# Altium schematic sheet Gandhvedh.U.K.SchDoc
size D
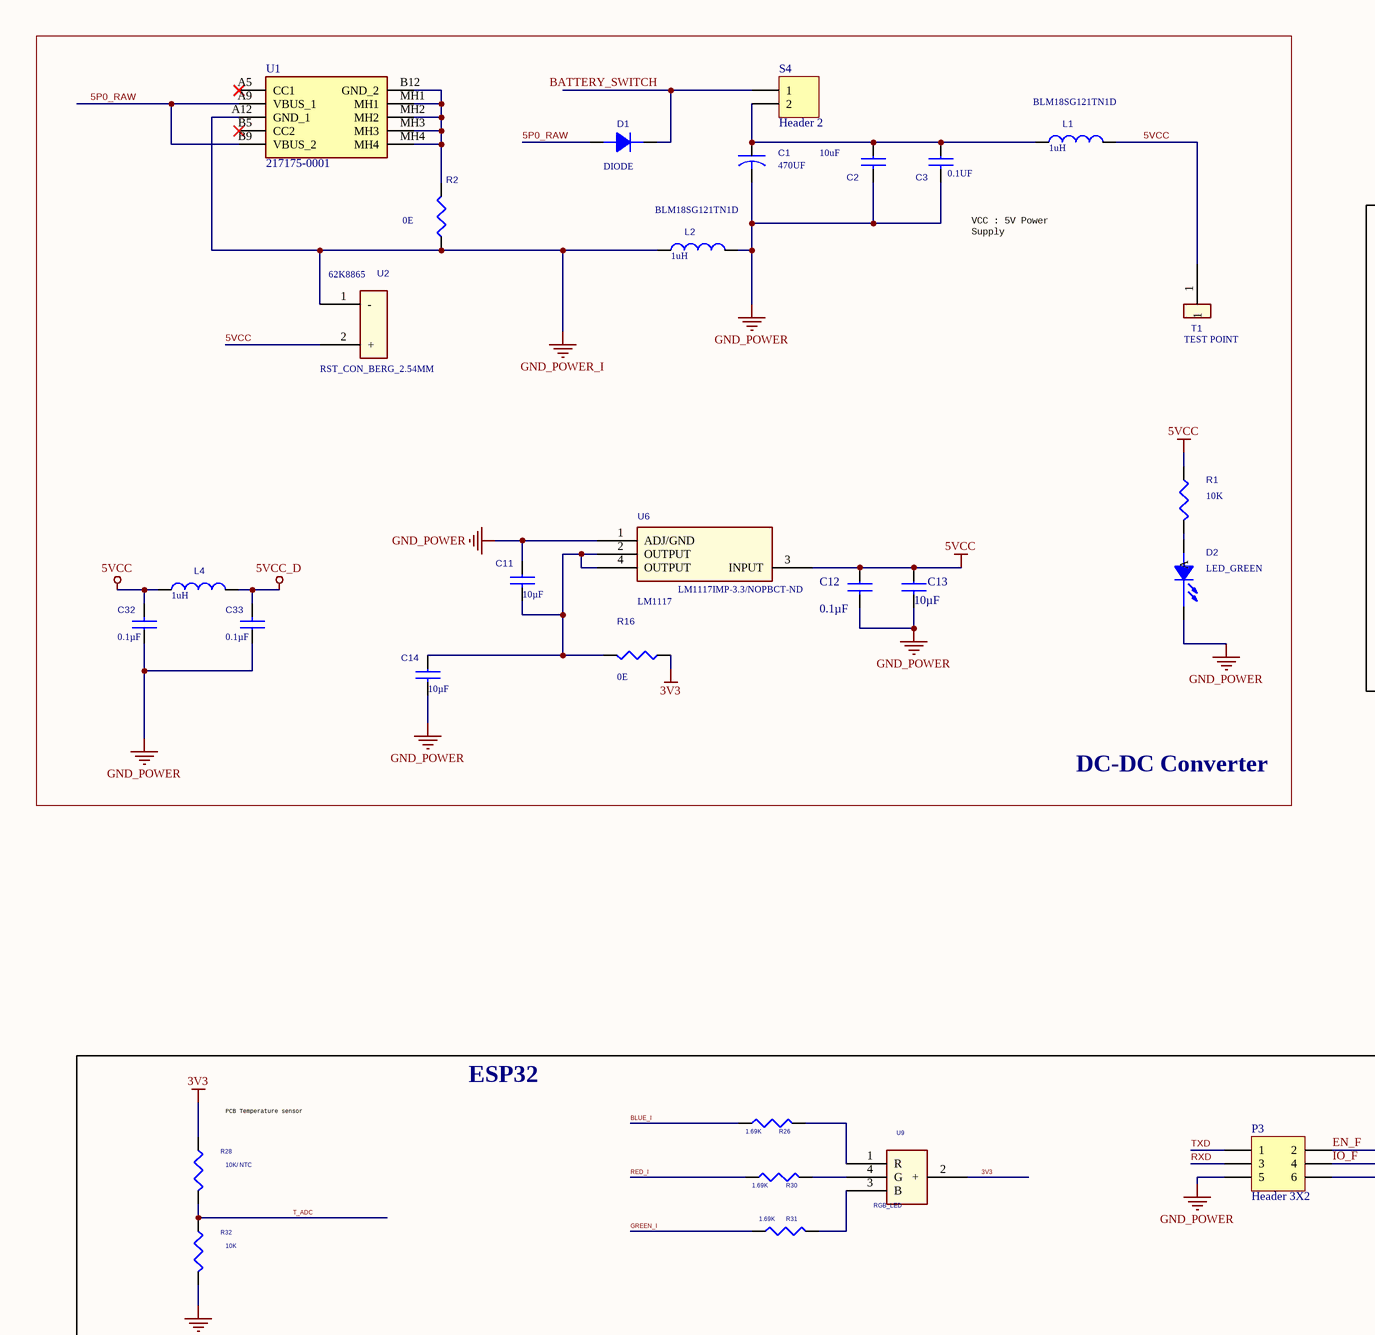
[diagram p0: Gandhvedh.U.K.SchDoc, top left]
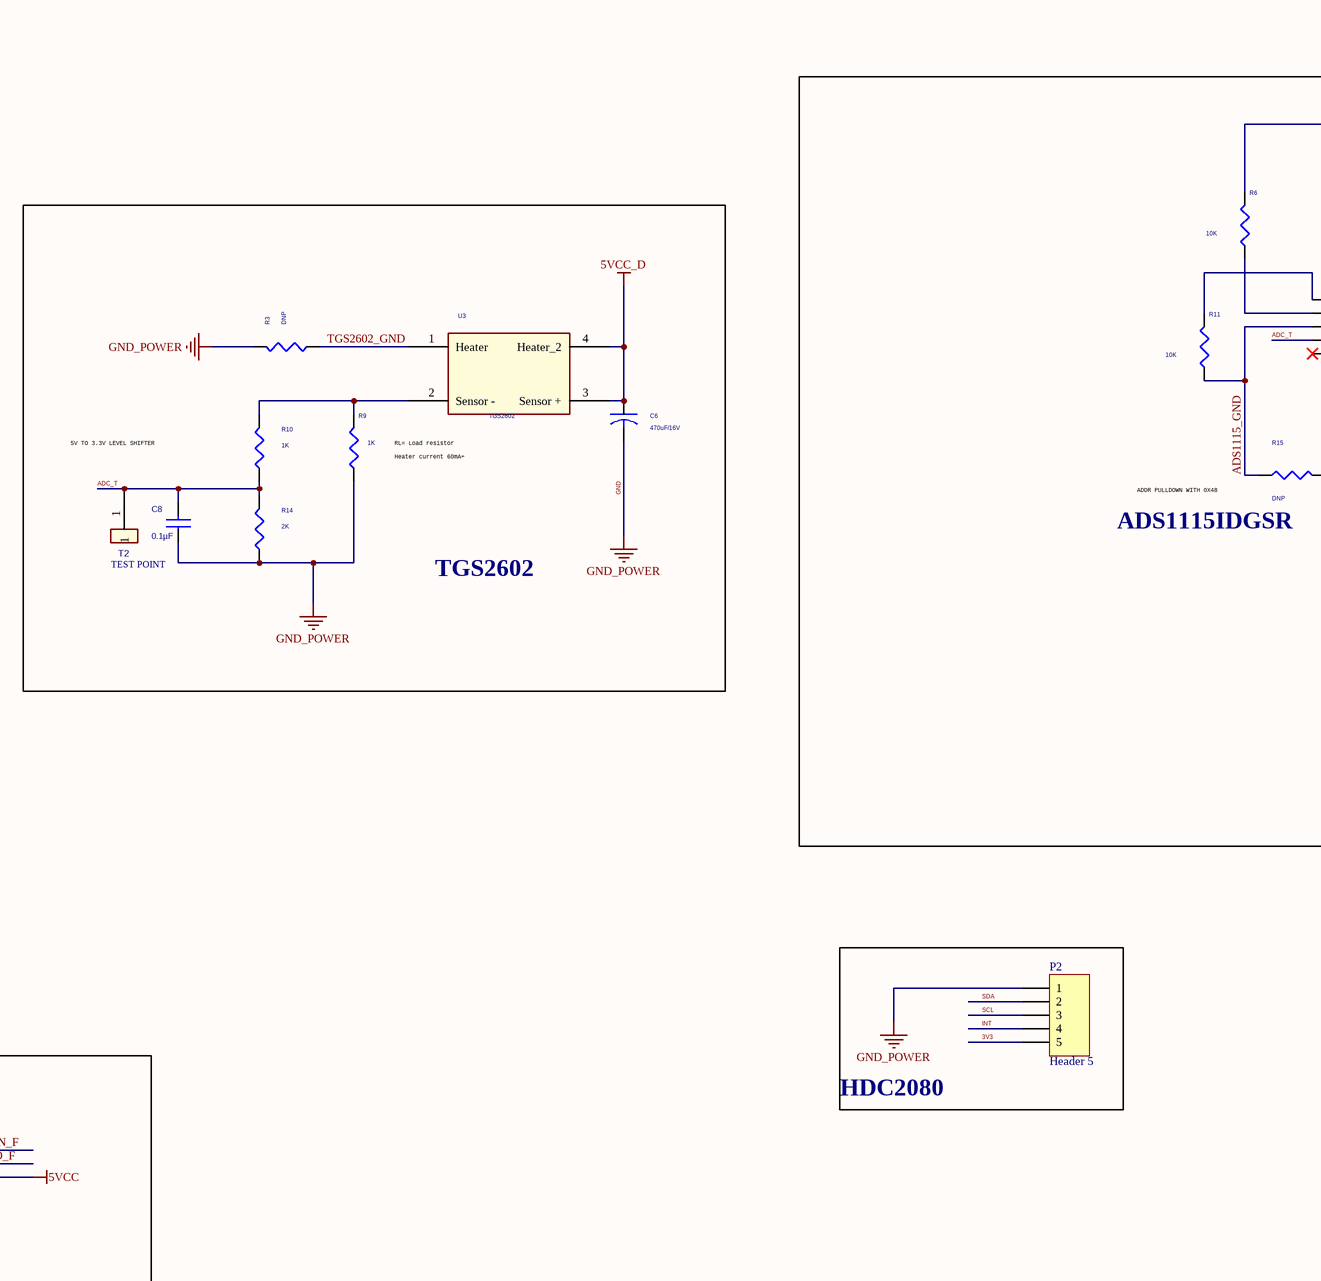
[diagram p1: Gandhvedh.U.K.SchDoc, top middle]
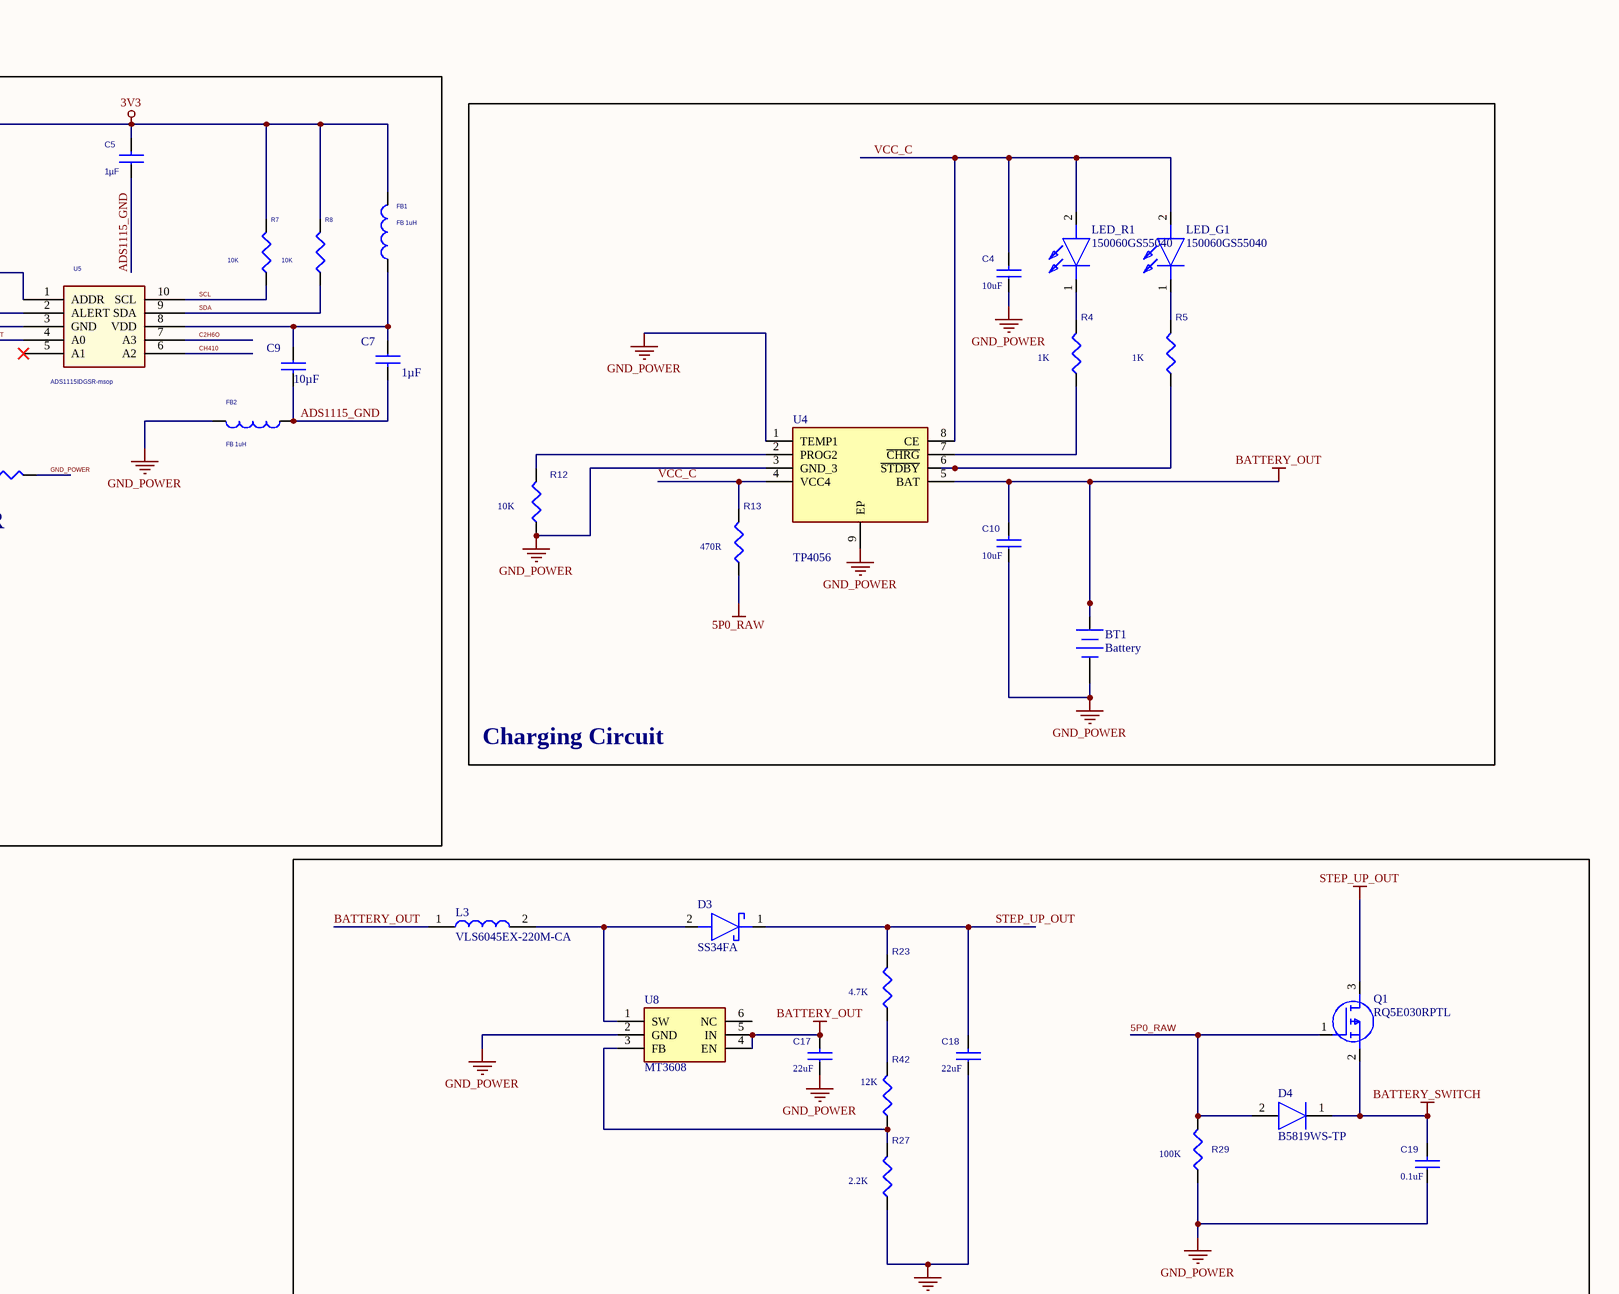
[diagram p2: Gandhvedh.U.K.SchDoc, top right]
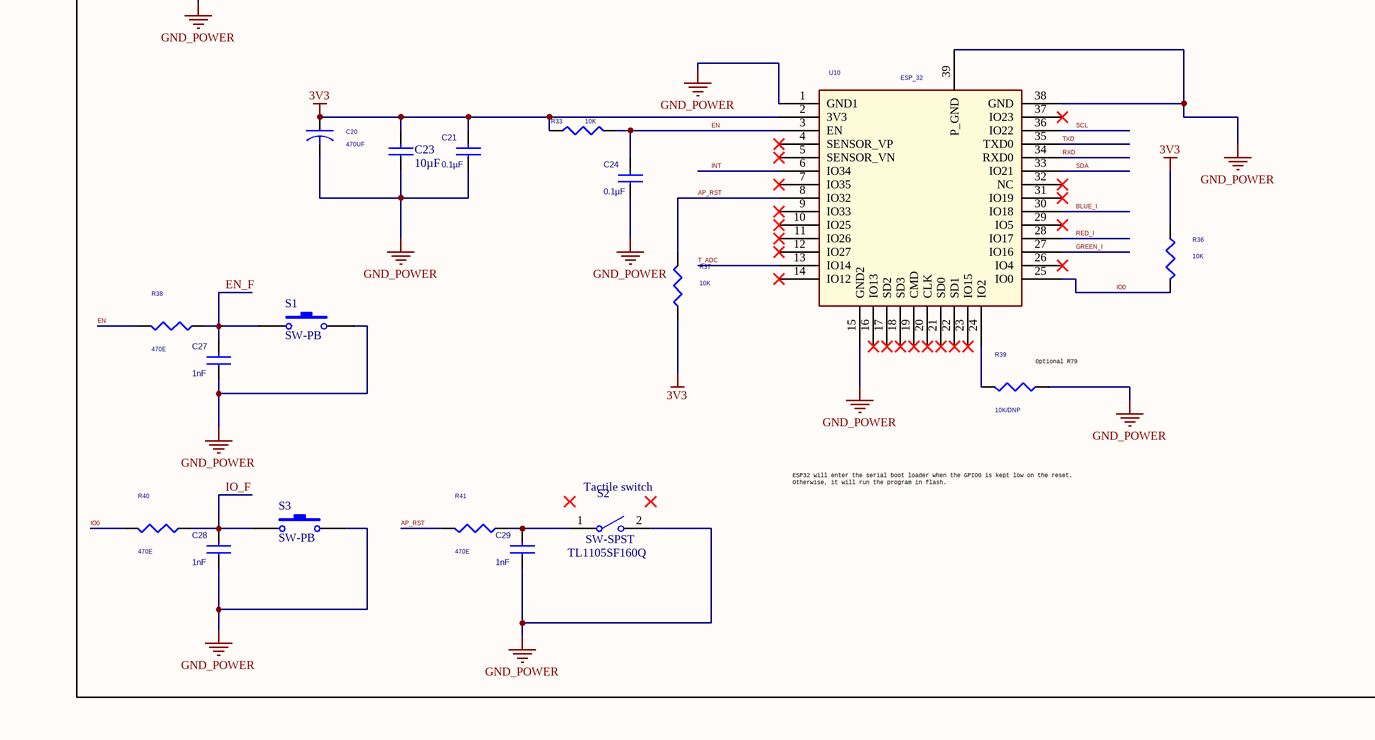
[diagram p3: Gandhvedh.U.K.SchDoc, bottom left]
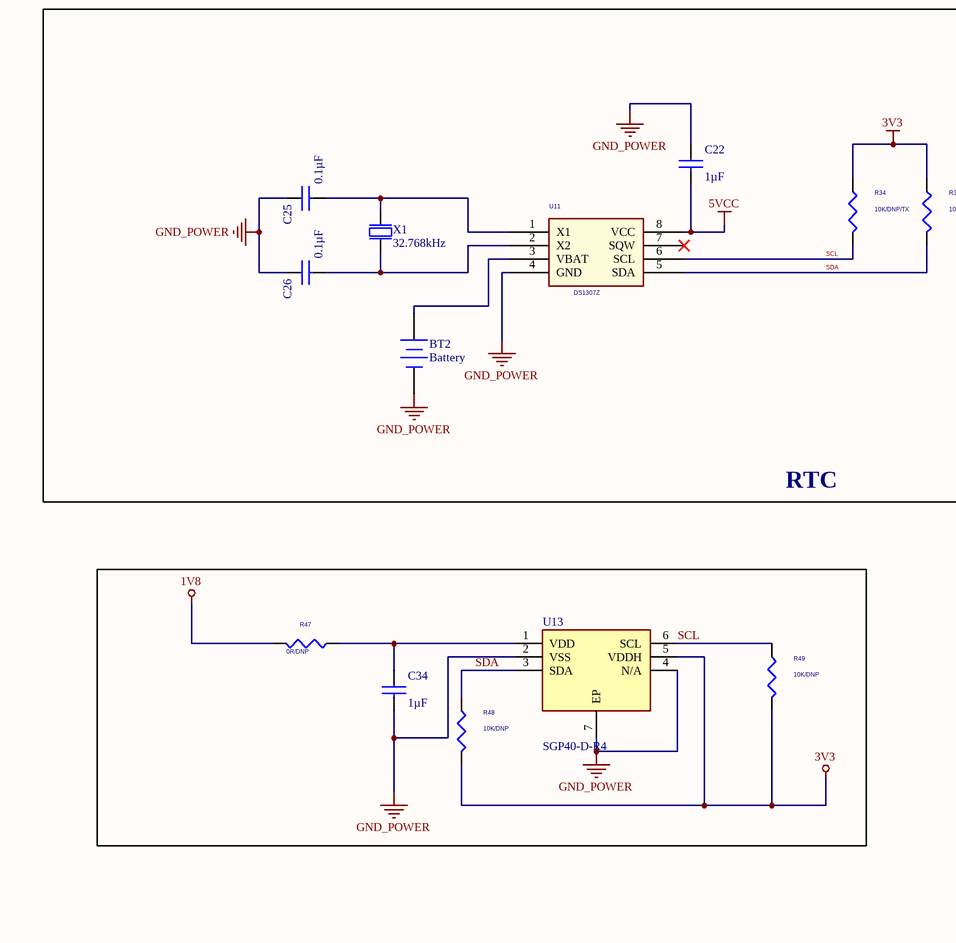
[diagram p4: Gandhvedh.U.K.SchDoc, bottom middle]
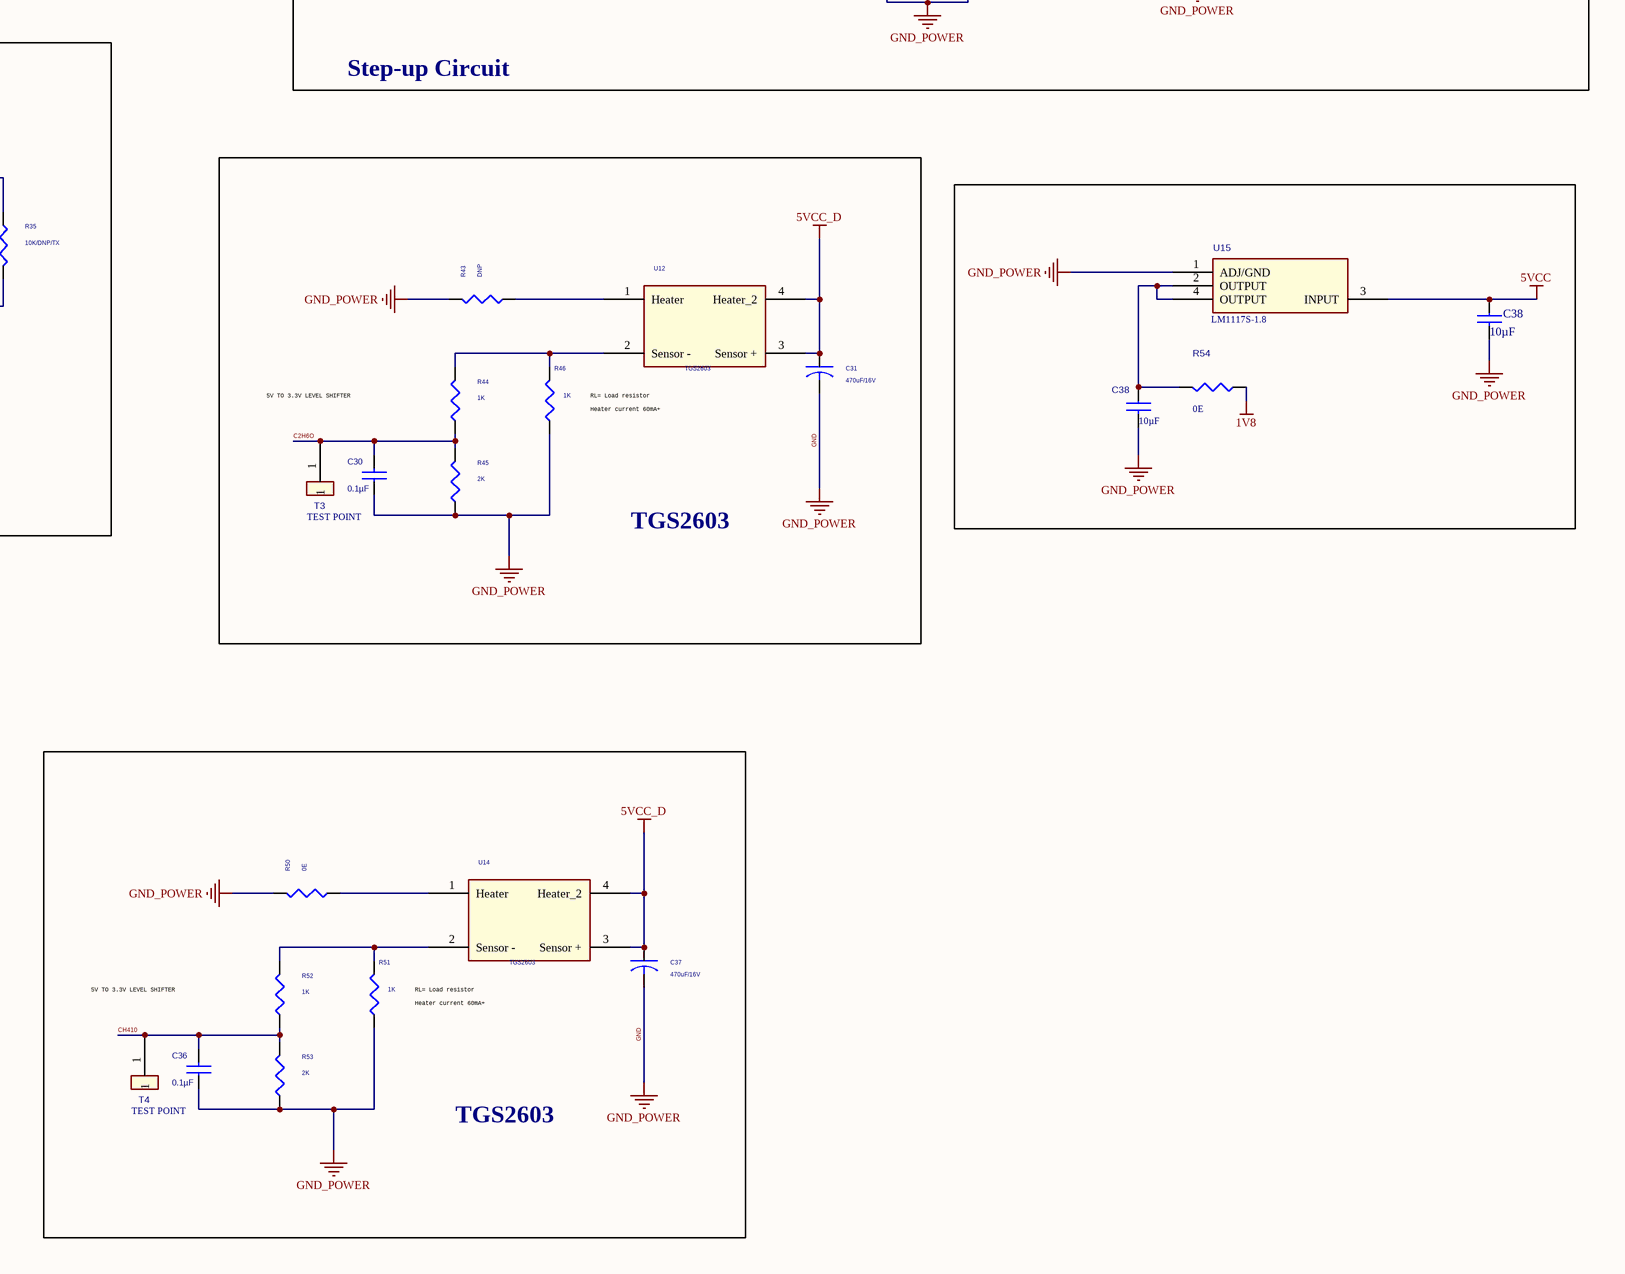
[diagram p5: Gandhvedh.U.K.SchDoc, bottom right]

## Parts
(Parts that share a designator on the sheet are numbered #1, #2 ... from top to bottom, then left to right.)
BT1  Battery  [BAT-2]
BT2  Battery  [MPD_BK-912-TR]
C1  470UF  [C16, C49, C58]
C2  10uF  [C0603]
C3  0.1UF  [C0603]
C4  10uF  [C0603]
C5  1µF  [C0603]
C6  470uF/16V  [C16, C49, C58]
C7  1µF  [C0603]
C8  0.1µF  [C0603]
C9  10µF  [C0603]
C10  10uF  [C0603]
C11  10µF  [C0603]
C12  0.1µF  [0603 Capacitor]
C13  10µF  [0603 Capacitor]
C14  10µF  [C0603]
C17  22uF  [C0603]
C18  22uF  [C0603]
C19  0.1uF  [C0603]
C20  470UF  [C16, C49, C58]
C21  0.1µF  [0603 Capacitor]
C22  1µF  [C0603]
C23  10µF  [C0603]
C24  0.1µF  [C0603]
C25  0.1µF  [C0603]
C26  0.1µF  [C0603]
C27  1nF  [C0603]
C28  1nF  [C0603]
C29  1nF  [C0603]
C30  0.1µF  [C0603]
C31  470uF/16V  [C16, C49, C58]
C32  0.1µF  [C0603]
C33  0.1µF  [C0603]
C34  1µF  [C0603]
C36  0.1µF  [C0603]
C37  470uF/16V  [C16, C49, C58]
C38#1  10µF  [C0603]
C38#2  10µF  [C0603]
D1  DIODE  [D1]
D2  LED_GREEN  [D2              L0603]
D3  SS34FA  [D1]
D4  B5819WS-TP  [D1]
FB1  FB 1uH  [0603 Capacitor]
FB2  FB 1uH  [0603 Capacitor]
L1  1uH  Supplier Part Number 1: BLM18SG121TN1D  [L3, L4, L5, L6, L7]
L2  1uH  Supplier Part Number 1: BLM18SG121TN1D  [L3, L4, L5, L6, L7]
L3  VLS6045EX-220M-CA  [VLS6045]
L4  1uH  [L3, L4, L5, L6, L7]
LED_G1  150060GS55040  [LEDC1608X50N]
LED_R1  150060GS55040  [LEDC1608X50N]
P2  Header 5  [HDR1X5]
P3  Header 3X2  [HDR2X3]
Q1  RQ5E030RPTL  [SOT95P280X100-3N]
R1  10K  [R0603]
R2  0E  [R0603]
R3  DNP  [R0603]
R4  1K  [R0603]
R5  1K  [R0603]
R6  10K  [R0603]
R7  10K  [R0603]
R8  10K  [R0603]
R9  1K  [R0603]
R10  1K  [R0603]
R11  10K  [R0603]
R12  10K  [R0603]
R13  470R  [R0603]
R14  2K  [R0603]
R15  DNP  [R0603]
R16  0E  [R0603]
R23  4.7K  [R0603]
R26  1.69K  [R0603]
R27  2.2K  [R0603]
R28  10K/ NTC  [R0603]
R29  100K  [R0603]
R30  1.69K  [R0603]
R31  1.69K  [R0603]
R32  10K  [R0603]
R33  10K  [R_0603_W]
R34  10K/DNP/TX  [R0603]
R35  10K/DNP/TX  [R0603]
R36  10K  [R0603]
R37  10K  [R0603]
R38  470E  [R0603]
R39  10K/DNP  [R0603]
R40  470E  [R0603]
R41  470E  [R0603]
R42  12K  [R0603]
R43  DNP  [R0603]
R44  1K  [R0603]
R45  2K  [R0603]
R46  1K  [R0603]
R47  0R/DNP  [R0603]
R48  10K/DNP  [R0603]
R49  10K/DNP  [R0603]
R50  0E  [R0603]
R51  1K  [R0603]
R52  1K  [R0603]
R53  2K  [R0603]
R54  0E  [R0603]
S1  SW-PB  [S2, S3]
S2  SW-SPST  Part Number: TL1105SF160Q  [S1]
S3  SW-PB  [S2, S3]
S4  Header 2  [HDR1X2]
T1  TEST POINT  [TP]
T2  TEST POINT  [TP]
T3  TEST POINT  [TP]
T4  TEST POINT  [TP]
U1  217175-0001  [2171750001]
U2  RST_CON_BERG_2.54MM  Supplier Part Number 1: 62K8865  [U23]
U3  TGS2602  [TGS2602]
U4  TP4056  [SOIC127P600X175-9N]
U5  ADS1115IDGSR-msop  [U19, U20]
U6  LM1117  Supplier Part Number 1: LM1117IMP-3.3/NOPBCT-ND  [U1, U24              SOT-223]
U8  MT3608  [SOT95P280X145-6N]
U9  RGB_LED  [WL-SFCW_1206]
U10  ESP_32  [U20             ESP 32 - duplicate]
U11  DS1307Z  [U6, U8                    SOIC-8N]
U12  TGS2603  [TGS2602]
U13  SGP40-D-R4  [SON80P244X244X95-7N]
U14  TGS2603  [U4]
U15  LM1117S-1.8  [U1, U24              SOT-223]
X1  32.768kHz  [XTAL]

## Blocks framed on the sheet
DC-DC Converter: C1-C3 C11-C14 C32 C33 D1 D2 L1 L2 L4 R1 R2 R16 S4 T1 U1 U2 U6
ADS1115IDGSR: C5 C7 C9 FB1 FB2 R6-R8 R11 R15 U5
Charging Circuit: BT1 C4 C10 LED_G1 LED_R1 R4 R5 R12 R13 U4
TGS2602: C6 C8 R3 R9 R10 R14 T2 U3
Step-up Circuit: C17-C19 D3 D4 L3 Q1 R23 R27 R29 R42 U8
HDC2080: P2
ESP32: C20 C21 C23 C24 C27-C29 P3 R26 R28 R30-R33 R36-R41 S1-S3 U9 U10
RTC: BT2 C22 C25 C26 R34 R35 U11 X1
TGS2603: C30 C31 R43-R46 T3 U12
TGS2603: C36 C37 R50-R53 T4 U14

## Nets
1V8: R47.2 R54.1
3V3: C5.2 C20.1 C21.2 C23.2 FB1.2 P2.5 R6.1 R7.1 R8.1 R16.1 R28.1 R33.1 R34.1 R35.1 R36.1 R37.1 R48.2 R49.2 U9.2(+) U10.2(3V3) U13.5(VDDH)
5P0_RAW: D1.2(A) D4.2(A) Q1.1(G) R13.2 R29.1 U1.A9(VBUS_1) U1.B9(VBUS_2)
5VCC: C12.1 C13.1 C22.2 C32.2 C38#1.1 L1.2 L4.1 P3.6 R1.1 T1.1 U2.2(+) U6.3(INPUT) U11.8(VCC) U15.3(INPUT)
5VCC_D: C6.1 C31.1 C33.2 C37.1 L4.2 U3.3(Sensor_+) U3.4(Heater_2) U12.3(Sensor_+) U12.4(Heater_2) U14.3(Sensor_+) U14.4(Heater_2)
BATTERY_OUT: BT1.1(+) C10.2 C17.2 L3.1 U4.5(BAT) U8.4(EN) U8.5(IN)
BATTERY_SWITCH: C19.2 D4.1(K) Q1.2(S)
GND: BT1.2(-) BT2.2(-) C1.2 C2.2 C3.2 C4.1 C6.2 C8.1 C10.1 C11.1 C12.2 C13.2 C14.2 C17.1 C18.1 C19.1 C20.2 C21.1 C22.1 C23.1 C24.1 C25.1 C26.1 C27.1 C28.1 C29.1 C30.1 C31.2 C32.1 C33.1 C34.2 C36.1 C37.2 C38#1.2 C38#2.2 D2.2(CATHODE) FB2.2 L2.2 P2.1 P3.5 R3.2 R9.2 R12.2 R14.1 R15.2 R27.2 R29.2 R32.2 R39.1 R43.2 R45.1 R46.2 R50.2 R51.2 R53.1 S1.2 S2.2(NO) S3.2 U4.1(TEMP1) U4.3(GND_3) U4.9(EP) U6.1(ADJ/GND) U8.2(GND) U10.1(GND1) U10.15(GND2) U10.38(GND) U10.39(P_GND) U11.4(GND) U13.2(VSS) U13.4(N/A) U13.7(EP) U15.1(ADJ/GND)  [also labelled GND_POWER]
GND_POWER_I: L2.1 R2.2 U1.A12(GND_1) U2.1(-)
STEP_UP_OUT: C18.2 D3.1(K) Q1.3(D) R23.1
ADC_T: C8.2 R10.1 R14.2 T2.1 U5.4(A0)
ADS1115_GND: C5.1 C7.2 C9.2 FB2.1 R11.2 R15.1 U5.3(GND)
AP_RST: R37.2 R41.2 U10.8(IO32)
BLUE_I: R26.1 U10.30(IO18)
C2H6O: C30.2 R44.1 R45.2 T3.1 U5.7(A3)
CH410: C36.2 R52.1 R53.2 T4.1 U5.6(A2)
EN: C24.2 R33.2 R38.2 U10.3(EN)
EN_F: C27.2 P3.2 R38.1 S1.1
GREEN_I: R31.1 U10.27(IO16)
INT: P2.4 U10.6(IO34)
IO0: R36.2 R40.2 U10.25(IO0)
IO_F: C28.2 P3.4 R40.1 S3.1
RED_I: R30.1 U10.28(IO17)
RXD: P3.3 U10.34(RXD0)
SCL: P2.3 R7.2 R34.2 R49.1 U5.10(SCL) U10.36(IO22) U11.6(SCL) U13.6(SCL)
SDA: P2.2 R8.2 R35.2 R48.1 U5.9(SDA) U10.33(IO21) U11.5(SDA) U13.3(SDA)
T_ADC: R28.2 R32.1 U10.13(IO14)
TGS2602_GND: R3.1 U3.1(Heater)
TXD: P3.1 U10.35(TXD0)
VCC_C: C4.2 LED_G1.2(A) LED_R1.2(A) R13.1 U4.4(VCC4) U4.8(CE)
NetBT2_1: BT2.1(+) U11.3(VBAT)
NetC1_1: C1.1 C2.1 C3.1 L1.1 S4.2
NetC7_1: C7.1 C9.1 FB1.1 U5.8(VDD)
NetC11_2: C11.2 C14.1 R16.2 U6.2(OUTPUT) U6.4(OUTPUT)
NetC25_2: C25.2 U11.1(X1) X1.1(inp)
NetC26_2: C26.2 U11.2(X2) X1.2(out)
NetC29_2: C29.2 R41.1 S2.1(COMMON)
NetC34_1: C34.1 R47.1 U13.1(VDD)
NetC38#2_1: C38#2.1 R54.2 U15.2(OUTPUT) U15.4(OUTPUT)
NetD1_1: D1.1(K) S4.1
NetD2_1: D2.1(A) R1.2
NetD3_2: D3.2(A) L3.2 U8.1(SW)
NetLED_G1_1: LED_G1.1(K) R5.1
NetLED_R1_1: LED_R1.1(K) R4.1
NetR2_1: R2.1 U1.B12(GND_2) U1.MH1 U1.MH2 U1.MH3 U1.MH4
NetR4_2: R4.2 U4.7(~{CHRG})
NetR5_2: R5.2 U4.6(~{STDBY})
NetR6_2: R6.2 U5.2(ALERT)
NetR9_1: R9.1 R10.2 U3.2(Sensor_-)
NetR11_1: R11.1 U5.1(ADDR)
NetR12_1: R12.1 U4.2(PROG2)
NetR23_2: R23.2 R42.1
NetR26_2: R26.2 U9.1(R)
NetR27_1: R27.1 R42.2 U8.3(FB)
NetR30_2: R30.2 U9.4(G)
NetR31_2: R31.2 U9.3(B)
NetR39_2: R39.2 U10.24(IO2)
NetR43_1: R43.1 U12.1(Heater)
NetR44_2: R44.2 R46.1 U12.2(Sensor_-)
NetR50_1: R50.1 U14.1(Heater)
NetR51_1: R51.1 R52.2 U14.2(Sensor_-)

Not connected (* = marked no-connect by the designer): U1 A5(CC1)* B5(CC2)*; U5 5(A1)*; U8 6(NC); U10 4(SENSOR_VP)* 5(SENSOR_VN)* 7(IO35)* 9(IO33)* 10(IO25)* 11(IO26)* 12(IO27)* 14(IO12)* 16(IO13)* 17(SD2)* 18(SD3)* 19(CMD)* 20(CLK)* 21(SD0)* 22(SD1)* 23(IO15)* 26(IO4)* 29(IO5)* 31(IO19)* 32(NC)* 37(IO23)*; U11 7(SQW)*

## Notes on the sheet
- VCC : 5V Power Supply
  D-  : USB D- Signal
  D+ : USB D+ Signal
  ID  : USB Identifier Signal for OTG Devices
  GND : Power Ground
- 5V TO 3.3V LEVEL SHIFTER
- RL= Load resistor
- Heater current 60mA+
- ADDR PULLDOWN WITH 0X48
- (near R28) PCB Temperature sensor
- (near R39) Optional R79
- (near S2) Tactile switch
- ESP32 will enter the serial boot loader when the GPIO0 is kept low on the reset.
  Otherwise, it will run the program in flash.
- Labels drawn without touching a wire or pin: BATTERY_SWITCH
- Title
- Size:
- Date:
- File:
- D
- Number:
- Time:
- Revision:
- Sheet
- of

## Library data of the parts
BT1 BT2 = Battery: Multicell Battery; Published: 24-Mar-1999; LatestRevisionDate: 17-Jul-2002; LatestRevisionNote: Re-released for DXP Platform.; PackageReference: BAT-2; Publisher: Altium Limited; PackageDescription: Battery; 2 Leads
C1 C6 C20 C31 C37 = CAP: CAP ALUM 470UF 20% 50V RADIAL; Part Number: 871-B41896E6477M000
C2 C3 = CAP NP: CAP CER 22UF 10V X5R 0603; Part Number: GRM188R61A226ME15D
C4 C10 C17-C19 = CAP_C_0.1µF/16V: CAP CER SMD 0.1µF/16V; Manufacturer: Murata Electronics North America; Manufacturer Part Number: GRM155R61H104KE19D; Capacitance: 1nF; Tolerance: ±10%; Voltage - Rated: 16V; Temperature Coefficient: X5R; Supplier 1: Digi-Key; Supplier Part Number 1: 490-11917-1-ND; RoHS: RoHS Compliant; Category: Capacitors; Stock 1: 958509; Pricing 1: 1=0.1, 10=0.062, 25=0.0456, 50=0.034, 100=0.0278, 250=0.02328, 500=0.01988, 1000=0.01562, 5000=0.01307 (USD); Packaging: Cut Tape (CT); Part Status: Active; Operating Temperature: -55°C ~ 85°C; Features: -; Ratings: -; Applications: General Purpose; Mounting Type: Surface Mount, MLCC; Size / Dimension: 0.039" L x 0.020" W (1.00mm x 0.50mm); Height - Seated (Max): -; Thickness (Max): 0.022" (0.55mm); Lead Spacing: -; Lead Style: -; ComponentLink1URL: http://www.murata.com/~/media/webrenewal/support/library/catalog/products/capacitor/mlcc/c02e.ashx; ComponentLink1Description: http://www.murata.com/~/media/webrenewal/support/library/catalog/products/capacitor/mlcc/c02e.ashx
C5 C8 C21 C24 C27-C30 C32 C33 C36 = CAP_C_0.1µF/16V: CAP CER SMD 0.1µF/16V; Manufacturer: Murata Electronics North America; Manufacturer Part Number: GRM155R61H104KE19D; Tolerance: ±10%; Voltage - Rated: 16V; Temperature Coefficient: X5R; Supplier 1: Digi-Key; Supplier Part Number 1: 490-11917-1-ND; RoHS: RoHS Compliant; Category: Capacitors; Stock 1: 958509; Pricing 1: 1=0.1, 10=0.062, 25=0.0456, 50=0.034, 100=0.0278, 250=0.02328, 500=0.01988, 1000=0.01562, 5000=0.01307 (USD); Packaging: Cut Tape (CT); Part Status: Active; Operating Temperature: -55°C ~ 85°C; Features: -; Ratings: -; Applications: General Purpose; Mounting Type: Surface Mount, MLCC; Package / Case: 0402 (1005 Metric); Size / Dimension: 0.039" L x 0.020" W (1.00mm x 0.50mm); Height - Seated (Max): -; Thickness (Max): 0.022" (0.55mm); Lead Spacing: -; Lead Style: -; ComponentLink1URL: http://www.murata.com/~/media/webrenewal/support/library/catalog/products/capacitor/mlcc/c02e.ashx; ComponentLink1Description: http://www.murata.com/~/media/webrenewal/support/library/catalog/products/capacitor/mlcc/c02e.ashx
  C5: Capacitance: 1µF
  C8 C21 C24 C30 C32 C33 C36: Capacitance: 0.1µF
  C27-C29: Capacitance: 1nF
C7 C12 C22 C25 C26 C34 = CAP_C_0.1µF/50V: CAP CER SMD 0.1µF/50V; Manufacturer: Yageo; Manufacturer Part Number: CC0805ZRY5V9BB104; Tolerance: -20%, +80%; Voltage - Rated: 50V; Temperature Coefficient: Y5V (F); Supplier 1: Digi-Key; Supplier Part Number 1: 311-1361-1-ND; RoHS: RoHS Compliant; Category: Capacitors; Stock 1: 934185; Pricing 1: 1=0.1, 10=0.036, 25=0.0264, 50=0.0198, 100=0.0162, 250=0.01352, 500=0.01156, 1000=0.00908 (USD); Packaging: Cut Tape (CT); Part Status: Active; Operating Temperature: -30°C ~ 85°C; Features: -; Ratings: -; Applications: General Purpose; Failure Rate: -; Mounting Type: Surface Mount, MLCC; Package / Case: 0805 (2012 Metric); Size / Dimension: 0.079" L x 0.049" W (2.00mm x 1.25mm); Height - Seated (Max): -; Thickness (Max): 0.024" (0.60mm); Lead Spacing: -; Lead Style: -; ComponentLink1URL: http://www.yageo.com/documents/recent/UPY-GPHC_Y5V_6.3V-to-50V_8.pdf; ComponentLink1Description: http://www.yageo.com/documents/recent/UPY-GPHC_Y5V_6.3V-to-50V_8.pdf
  C7 C22 C34: Capacitance: 1µF
  C12 C25 C26: Capacitance: 0.1µF
C9 C11 C13 C14 C38#1 C38#2 = CAP_C_10µF/35V: CAP CER SMD 10µF/35V; Manufacturer: Taiyo Yuden; Manufacturer Part Number: GMK316AB7106KL-TR; Tolerance: ±10%; Voltage - Rated: 35V; Temperature Coefficient: X7R; Supplier 1: Digi-Key; Supplier Part Number 1: 587-3007-1-ND; RoHS: RoHS Compliant; Category: Capacitors; Stock 1: 533940; Pricing 1: 1=0.51, 10=0.362, 25=0.3092, 50=0.274, 100=0.2387, 250=0.20328, 500=0.17678, 1000=0.15026 (USD); Packaging: Cut Tape (CT); Part Status: Active; Capacitance: 10µF; Operating Temperature: -55°C ~ 125°C; Features: -; Ratings: -; Applications: General Purpose; Mounting Type: Surface Mount, MLCC; Package / Case: 1206 (3216 Metric); Size / Dimension: 0.126" L x 0.063" W (3.20mm x 1.60mm); Height - Seated (Max): -; Thickness (Max): 0.071" (1.80mm); Lead Spacing: -; Lead Style: -; ComponentLink1URL: http://www.yuden.co.jp/productdata/catalog/en/mlcc06_e.pdf; ComponentLink1Description: http://www.yuden.co.jp/productdata/catalog/en/mlcc06_e.pdf
C23 = CAP_C_10µF/10V: CAP CER SMD 10µF/10V; Manufacturer: Yageo; Manufacturer Part Number: CC0805ZKY5V6BB106; Tolerance: -20%, +80%; Voltage - Rated: 10V; Temperature Coefficient: Y5V (F); Supplier 1: Digi-Key; Supplier Part Number 1: 311-1355-1-ND; RoHS: RoHS Compliant; Category: Capacitors; Stock 1: 595702; Pricing 1: 1=0.18, 10=0.131, 25=0.0956, 50=0.0742, 100=0.0615, 250=0.05088, 500=0.04312, 1000=0.03569 (USD); Packaging: Cut Tape (CT); Part Status: Active; Capacitance: 10µF; Operating Temperature: -30°C ~ 85°C; Features: -; Ratings: -; Applications: General Purpose; Failure Rate: -; Mounting Type: Surface Mount, MLCC; Package / Case: 0805 (2012 Metric); Size / Dimension: 0.079" L x 0.049" W (2.00mm x 1.25mm); Height - Seated (Max): -; Thickness (Max): 0.049" (1.25mm); Lead Spacing: -; Lead Style: -; ComponentLink1URL: http://www.yageo.com/documents/recent/UPY-GPHC_Y5V_6.3V-to-50V_8.pdf; ComponentLink1Description: http://www.yageo.com/documents/recent/UPY-GPHC_Y5V_6.3V-to-50V_8.pdf
D1 = DIODE: DIODE GEN PURP 1KV 1A DO214AC; part number: 641-1018-2-ND
D2 = LED: LED GREEN CLEAR THIN 0603 SMD; Manufacturer Part Number: 160-1443-2-ND; Type: Diode; Distributor Part Number: 160-1443-1-ND; Package: 0603; Part Number: 160-1443-2-ND; Supplier 1: Future Electronics; Supplier Part Number 1: LTL-1CHG-BAG
D3 = SS34FA: Schottky Diode; Manufacturer_Name: ON Semiconductor; Datasheet Link: http://www.onsemi.com/pub/Collateral/SS36FA-D.pdf; Height: 1.43mm; Manufacturer_Part_Number: SS34FA; Mouser Part Number: 512-SS34FA; Mouser Price/Stock: https://www.mouser.co.uk/ProductDetail/ON-Semiconductor-Fairchild/SS34FA?qs=R26iFe%2FkX%2FK1QUwZdCmBBw%3D%3D; Arrow Part Number: SS34FA; Arrow Price/Stock: https://www.arrow.com/en/products/ss34fa/on-semiconductor?region=nac
D4 = B5819WS-TP: Diode; Manufacturer_Name: Micro Commercial Components (MCC); Datasheet Link: https://www.arrow.com/en/products/b5819ws-tp/micro-commercial-components; Height: 1.15mm; Manufacturer_Part_Number: B5819WS-TP; Mouser Part Number: 833-B5819WS-TP; Mouser Price/Stock: https://www.mouser.co.uk/ProductDetail/Micro-Commercial-Components-MCC/B5819WS-TP?qs=SdqRYZZ9IxBOLbXcW6zYBA%3D%3D; Arrow Part Number: B5819WS-TP; Arrow Price/Stock: https://www.arrow.com/en/products/b5819ws-tp/micro-commercial-components?region=asia
FB1 FB2 = INDUCTOR: FILTER CHIP 120 OHM 3A 0603; Manufacturer Part Number: MMZ2012Y152B; Type: Ferrite; Package: 0603; Distributor Part Number: MMZ2012Y152B; Part Number: MMZ2012Y152B
L1 L2 L4 = INDUCTOR: FERRITE BEAD 120 OHM 0603 1LN; Part Number: 490-3996-1-ND; Supplier 1: Arrow
  L4: Supplier Part Number 1: BLM18SG121TN1D
L3 = VLS6045EX-220M-CA: Inductor; Manufacturer_Name: TDK; Datasheet Link: https://product.tdk.com/system/files/dam/doc/product/inductor/inductor/smd/catalog/inductor_automotive_power_vls6045ex-ca_en.pdf; Manufacturer_Part_Number: VLS6045EX-220M-CA; Mouser Part Number: 810-VLS6045EX220MCA; Mouser Price/Stock: https://www.mouser.com/Search/Refine.aspx?Keyword=810-VLS6045EX220MCA; Arrow Part Number: VLS6045EX-220M-CA; Arrow Price/Stock: https://www.arrow.com/en/products/vls6045ex-220m-ca/tdk
LED_G1 LED_R1 = 150060GS55040: LED; Manufacturer_Name: Wurth Elektronik; Datasheet Link: https://katalog.we-online.de/led/datasheet/150060GS55040.pdf; Height: 0.5mm; Manufacturer_Part_Number: 150060GS55040; Mouser Part Number: 710-150060GS55040; Mouser Price/Stock: https://www.mouser.co.uk/ProductDetail/Wurth-Elektronik/150060GS55040?qs=fAHHVMwC%252Bbhr5Aln2oA6Nw%3D%3D
P2 = Header 5: Header, 5-Pin; LatestRevisionDate: 17-Jul-2002; LatestRevisionNote: Re-released for DXP Platform.; Publisher: Altium Limited
P3 = Header 3X2: Header, 3-Pin, Dual row; LatestRevisionDate: 17-Jul-2002; LatestRevisionNote: Re-released for DXP Platform.; Publisher: Altium Limited
Q1 = RQ5E030RPTL: MOSFET (P-Channel); Manufacturer_Name: ROHM Semiconductor; Datasheet Link: https://www.mouser.com/datasheet/2/348/rq5e030rp-e-1596311.pdf; Height: 1mm; Manufacturer_Part_Number: RQ5E030RPTL; Mouser Part Number: 755-RQ5E030RPTL; Mouser Price/Stock: https://www.mouser.com/Search/Refine.aspx?Keyword=755-RQ5E030RPTL
R1 R10 R44 R52 = R: RES SMD 1K OHM 5% 1/10W 0603; Part Number: 311-1.0KGRTR-ND; Package: 0603; Type: Resistor
R2 R4 R5 R12 R13 R23 R27 R29 R42 = R: RES SMD 4.7K OHM 1% 1/16W 0603; Manufacturer Part Number: 1276-3466-2-ND; Manufacturer: Samsung; Part Number: P4.7KDBCT-ND; Type: Resistor; Rating: 1/16W; Tolerance: 1%; Distributor: Digikey; Distributor Part Number: 1276-3466-2-ND; Package: 0603
R3 R15 R43 R50 = R: Type: Resistor; Package: 0603
R6-R8 R11 = R: RES SMD 4.7K OHM 1% 1/16W 0603; Manufacturer Part Number: 1276-3466-2-ND; Manufacturer: Samsung; Part Number: 311-10KGRTR-ND; Type: Resistor; Rating: 1/16W; Tolerance: 1%; Distributor: Digikey; Distributor Part Number: 1276-3466-2-ND; Package: 0603
R9 R46 R51 = R: RES SMD 1K OHM 5% 1/10W 0603; Part Number: 311-1.0KGRTR-ND; Manufacturer Part Number: 1276-3466-2-ND; Manufacturer: Samsung; Rating: 1/16W; Tolerance: 1%; Type: Resistor; Distributor: Digikey; Distributor Part Number: 1276-3466-2-ND; Package: 0603
R14 R45 R53 = R: RES SMD 2K OHM 1% 1/10W 0603; Part Number: YAG1297CT-ND; Package: 0603; Type: Resistor
R16 R38 R40 R41 R54 = R: RES SMD 470 OHM 1% 1/10W 0603; Part Number: 311-470HRCT-ND; Type: Resistor; Package: 0603
R26 R30-R37 R39 R47-R49 = R: RES SMD 4.7K OHM 1% 1/16W 0603; Part Number: 311-10KGRTR-ND; Package: 0603; Type: Resistor
R28 = R: THERMISTOR NTC 10KOHM 3380K 0603; Part Number: 490-16279-2-ND; Type: Resistor; Package: 0603
S1 S3 = SW-PB: Switch; Published: 24-Mar-1999; LatestRevisionDate: 17-Jul-2002; LatestRevisionNote: Re-released for DXP Platform.; PackageReference: SPST-2; Publisher: Altium Limited; PackageDescription: Switch; 2 Leads
S2 = SW-SPST: SWITCH TACTILE SPST-NO 0.05A 12V; Published: 24-Mar-1999; LatestRevisionDate: 17-Jul-2002; LatestRevisionNote: Re-released for DXP Platform.; PackageReference: SPST-2; Publisher: Altium Limited; PackageDescription: Switch; 2 Leads
S4 = Header 2: Header, 2-Pin; LatestRevisionDate: 17-Jul-2002; LatestRevisionNote: Re-released for DXP Platform.; Publisher: Altium Limited
T1-T4 = Test_P
U1 = 217175-0001: Connector; Manufacturer_Name: Molex; Datasheet Link: https://www.molex.com/pdm_docs/sd/2171750001_sd.pdf; Height: 3.46mm; Manufacturer_Part_Number: 217175-0001; Mouser Part Number: 538-217175-0001; Mouser Price/Stock: https://www.mouser.co.uk/ProductDetail/Molex/217175-0001?qs=DRkmTr78QARWJMiqNnldSg%3D%3D
U2 = CON_AC_1: CONN HEADER VERT 2POS 2.54MM; Part Number: 609-4434-ND; Supplier 1: Newark
U3 U12 U14 = TGS2602_1: Part Number: TGS2602
U4 = TP4056: Connector; Manufacturer_Name: NanJing Top Power; Datasheet Link: https://dlnmh9ip6v2uc.cloudfront.net/datasheets/Prototyping/TP4056.pdf; Height: 1.75mm; Manufacturer_Part_Number: TP4056
U5 = ADS1115: IC ADC 16BIT SIGMA-DELTA 10VSSOP; Part Number: 595-ADS1115IDGST
U6 = TLV70033DDCT: 3.3V LDO; Manufacturer: Texas Instruments; Regulator Topology: Positive Fixed; Current - Output: 200mA; Voltage - Input: Up to 5.5V; Current - Limit (Min): 220mA; Manufacturer Part Number: LM1117; RoHS: RoHS Compliant; Category: Integrated Circuits (ICs); Stock 1: 5021; Pricing 1: 1=0.53, 10=0.452, 100=0.3374 (USD); Packaging: Cut Tape (CT); Part Status: Active; Voltage - Output: 3.3V; Voltage - Dropout (Typical): -; Operating Temperature: -40°C ~ 125°C; Mounting Type: Surface Mount; Package / Case: SOT-23-5 Thin, TSOT-23-5; Supplier Device Package: SOT-23-5; ComponentLink1URL: http://www.ti.com/lit/ds/slvsa00e/slvsa00e.pdf; ComponentLink1Description: http://www.ti.com/lit/ds/slvsa00e/slvsa00e.pdf; Supplier 1: Digi-Key
U8 = MT3608: Undefined or Miscellaneous; Manufacturer_Name: Aerosemi; Datasheet Link: https://www.olimex.com/Products/Breadboarding/BB-PWR-3608/resources/MT3608.pdf; Height: 1.45mm; Manufacturer_Part_Number: MT3608
U9 = RGB_LED_PTH_0: Part Number: 754-1492-ND
U10 = ESP32_SMD_1: WIFI MODULE 128MBITS SPI FLASH; Part Number: 356-ES32WROOM32D16MB
U11 = MP1584_SOIC_0: IC REG BUCK ADJUSTABLE 3A 8SOIC; Part Number: 1589-1533-1-ND
U13 = SGP40-D-R4: Integrated Circuit; Manufacturer_Name: Sensirion; Datasheet Link: https://www.mouser.com/datasheet/2/682/Sensirion_Gas_Sensors_SGP40_Datasheet-1888696.pdf; Height: 0.95mm; Manufacturer_Part_Number: SGP40-D-R4; Mouser Part Number: 403-SGP40-D-R4; Mouser Price/Stock: https://www.mouser.co.uk/ProductDetail/Sensirion/SGP40-D-R4?qs=yqaQSyyJnNgaRqiZfsbS1Q%3D%3D; Arrow Part Number: SGP40-D-R4; Arrow Price/Stock: https://www.arrow.com/en/products/sgp40-d-r4/sensirion-ag?region=europe
U15 = TLV70033DDCT: 3.3V LDO; Manufacturer: Texas Instruments; Manufacturer Part Number: LM1117; Regulator Topology: Positive Fixed; Current - Output: 200mA; Voltage - Input: Up to 5.5V; Current - Limit (Min): 220mA; RoHS: RoHS Compliant; Category: Integrated Circuits (ICs); Stock 1: 5021; Pricing 1: 1=0.53, 10=0.452, 100=0.3374 (USD); Packaging: Cut Tape (CT); Part Status: Active; Voltage - Output: 3.3V; Voltage - Dropout (Typical): -; Operating Temperature: -40°C ~ 125°C; Mounting Type: Surface Mount; Package / Case: SOT-23-5 Thin, TSOT-23-5; Supplier Device Package: SOT-23-5; ComponentLink1URL: http://www.ti.com/lit/ds/slvsa00e/slvsa00e.pdf; ComponentLink1Description: http://www.ti.com/lit/ds/slvsa00e/slvsa00e.pdf; Supplier 1: Digi-Key; Supplier Part Number 1: LM1117IMP-3.3/NOPBCT-ND
X1 = XTAL_2-pin: XTAL SMD 3215, 32.768kHz, Cl=9pF, Total Tol: ±50ppm; Part Number: XTAL_SMD3215_32.768kHz_9pF_General; Note: XTAL SMD 32.768kHz; Artikkelnr Noca: N.A.; Manufacturer: *; Manufacturer Part Number: *; Datasheet: *; LatestRevisionDate: 2016-08-19; Pin Count: 2; Publisher: Nordic Semiconductor; Published: 2016-08-19; Value: 32.768kHz; Supplier: *; Supplier part number: *; 2nd source Supplier: *; 2nd source part number: *; Footprint Doc: XTAL_3215; Artikkelnr Simpro: N.A.